# EAGLE design alarm (EAGLE 7.5.0)
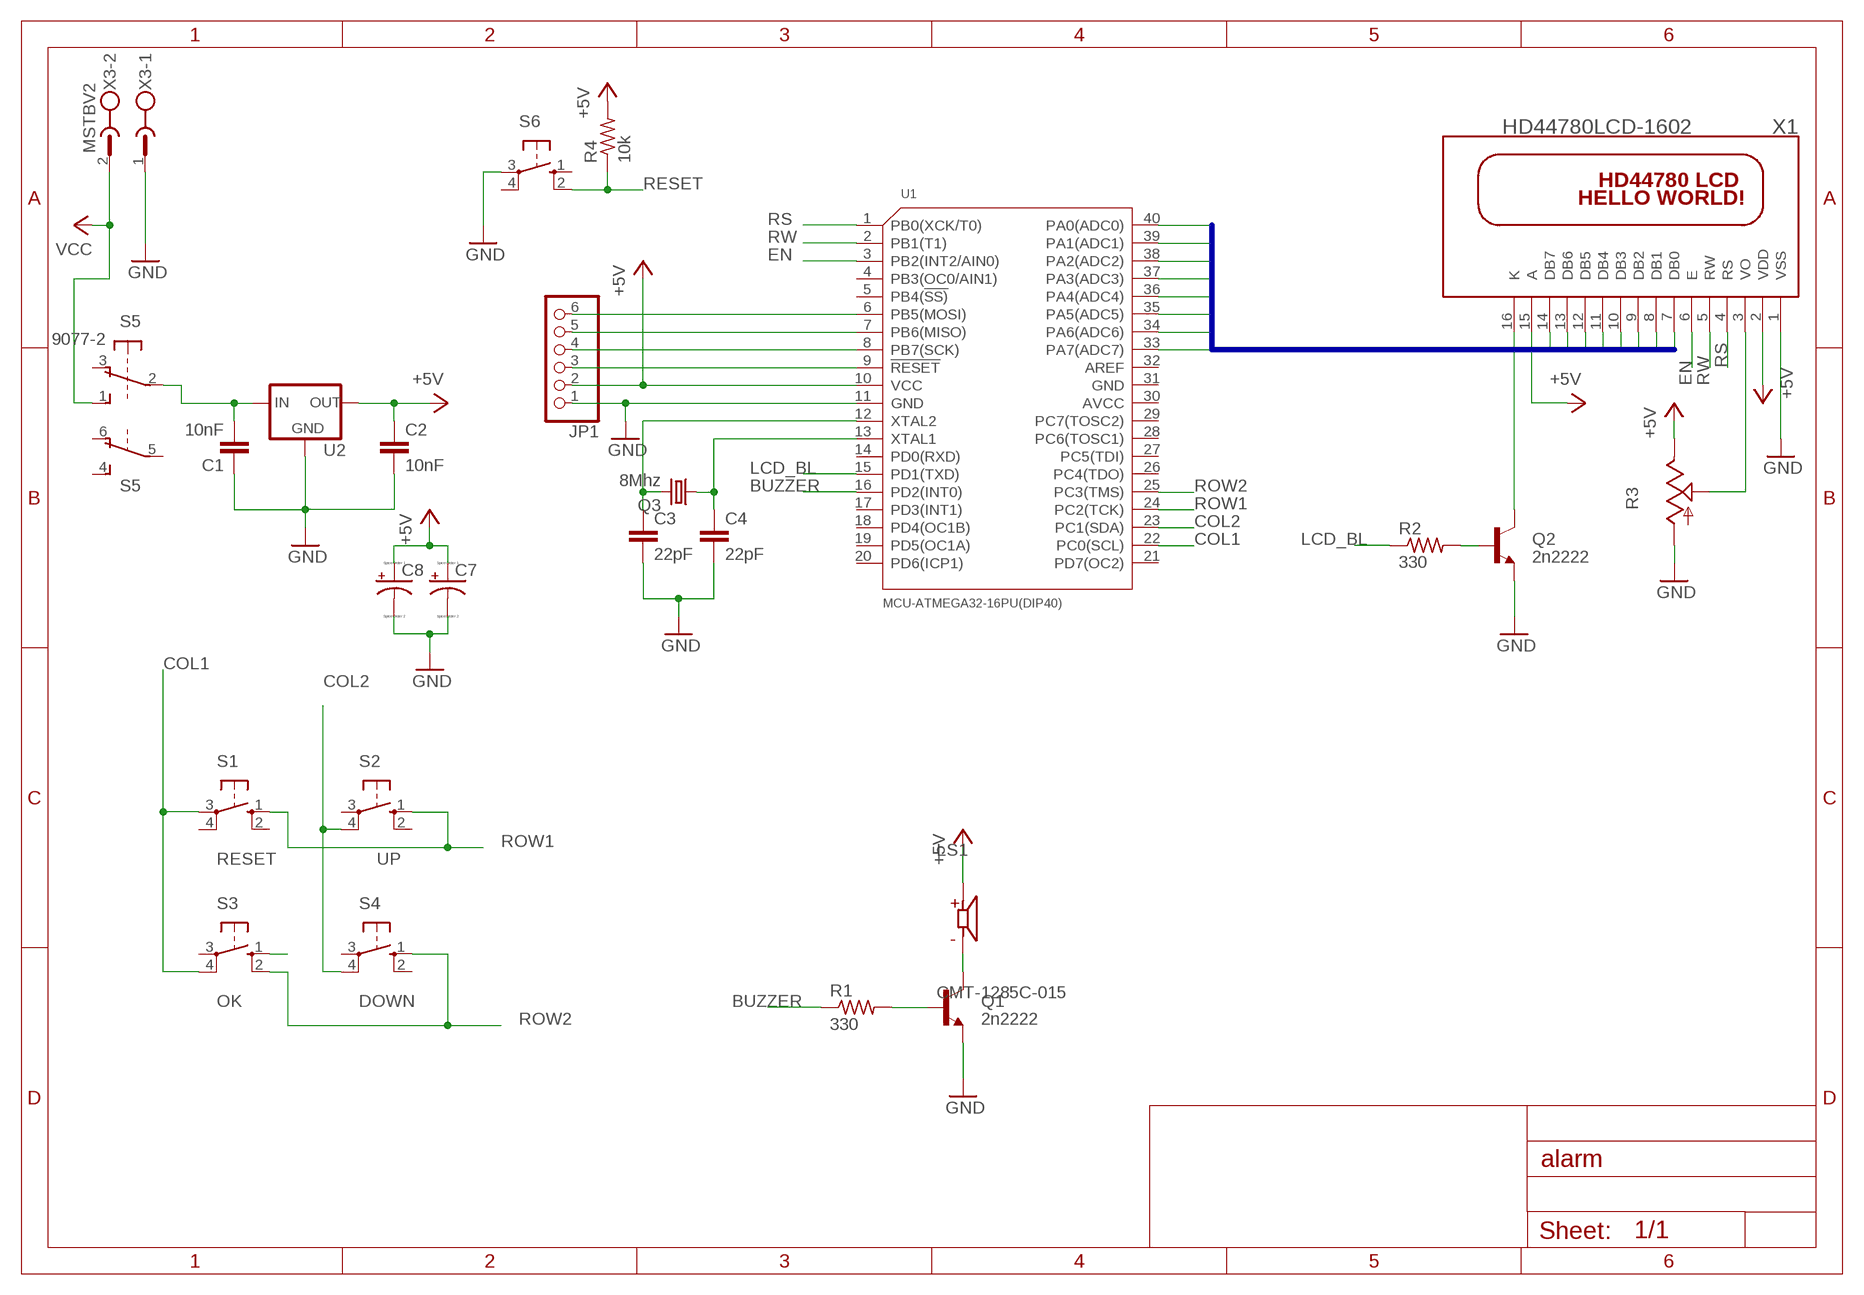
[diagram p0: schematic, sheet 1]

## Parts
C1  10nF  C-EU025-025X050  [C025-025X050]
C2  10nF  C-EU025-025X050  [C025-025X050]
C3  22pF  C-EU025-025X050  [C025-025X050]
C4  22pF  C-EU025-025X050  [C025-025X050]
C7  CPOL-USE2.5-6  [E2,5-6]
C8  CPOL-USE2.5-6  [E2,5-6]
JP1  PINHD-1X6  [1X06]
LS1  CMT-1285C-015  [CUI_CMT-1285C-015]
Q1  2n2222  TRANSISTOR_NPNP2N2222A  [TO-92]
Q2  2n2222  TRANSISTOR_NPNP2N2222A  [TO-92]
Q3  8Mhz  CRYSTALHC49S  [HC49/S]
R1  330  R-US_0207/10  [0207/10]
R2  330  R-US_0207/10  [0207/10]
R3  TRIM_US-RS3  [RS3]
R4  10k  R-US_0207/10  [0207/10]
S1  10-XX  [B3F-10XX]
S2  10-XX  [B3F-10XX]
S3  10-XX  [B3F-10XX]
S4  10-XX  [B3F-10XX]
S5  9077-2  [9077-2]
S6  10-XX  [B3F-10XX]
U1  MCU-ATMEGA32-16PU(DIP40)  [DIP40-2.54-52.3X15.24MM]
U2  78XXL  [78XXL]
X1  HD44780LCD-1602  [LCD1602]
X3  MSTBV2  [MSTBV2]

## Nets
+5V: C2.1 C7.+ C8.+ JP1.2 LS1.P R3.E R4.2 U1.10(VCC) U2.OUT X1.2(VDD) X1.15(A)
BUZZER: R1.1 U1.16(PD2(INT0))
COL1: S1.3(P) S3.4(P1) U1.22(PC0(SCL))
COL2: S2.4(P1) S4.4(P1) U1.23(PC1(SDA))
EN: U1.3(PB2(INT2/AIN0)) X1.6(E)
GND: C1.1 C2.2 C3.2 C4.2 C7.- C8.- JP1.1 Q1.3(E) Q2.3(E) R3.A S6.3(P) U1.11(GND) U2.GND X1.1(VSS) X3.1
LCD_BL: R2.1 U1.15(PD1(TXD))
N$1: C1.2 S5.2(1:P) U2.IN
N$2: Q1.2(B) R1.2
N$3: LS1.N Q1.1(C)
N$4: C3.1 Q3.2 U1.12(XTAL2)
N$5: C4.1 Q3.1 U1.13(XTAL1)
N$6: S3.1(S)
N$9: JP1.4 U1.8(PB7(SCK))
N$10: JP1.5 U1.7(PB6(MISO))
N$11: JP1.6 U1.6(PB5(MOSI))
N$12: Q2.1(C) X1.16(K)
N$13: Q2.2(B) R2.2
N$14: R3.S X1.3(VO)
PA0: U1.40(PA0(ADC0)) X1.7(DB0)
PA1: U1.39(PA1(ADC1)) X1.8(DB1)
PA2: U1.38(PA2(ADC2)) X1.9(DB2)
PA3: U1.37(PA3(ADC3)) X1.10(DB3)
PA4: U1.36(PA4(ADC4)) X1.11(DB4)
PA5: U1.35(PA5(ADC5)) X1.12(DB5)
PA6: U1.34(PA6(ADC6)) X1.13(DB6)
PA7: U1.33(PA7(ADC7)) X1.14(DB7)
RESET: JP1.3 R4.1 S6.2(S1) U1.9(!RESET)
ROW1: S1.1(S) S2.1(S) U1.24(PC2(TCK))
ROW2: S3.2(S1) S4.1(S) U1.25(PC3(TMS))
RS: U1.1(PB0(XCK/T0)) X1.4(RS)
RW: U1.2(PB1(T1)) X1.5(RW)
VCC: S5.1(1:S) X3.2
Unconnected: S1.2(S1) S1.4(P1) S2.2(S1) S2.3(P) S3.3(P) S4.2(S1) S4.3(P) S5.3(1:O) S5.4(2:S) S5.5(2:P) S5.6(2:O) S6.1(S) S6.4(P1) U1.4(PB3(OC0/AIN1)) U1.5(PB4(!SS)) U1.14(PD0(RXD)) U1.17(PD3(INT1)) U1.18(PD4(OC1B)) U1.19(PD5(OC1A)) U1.20(PD6(ICP1)) U1.21(PD7(OC2)) U1.26(PC4(TDO)) U1.27(PC5(TDI)) U1.28(PC6(TOSC1)) U1.29(PC7(TOSC2)) U1.30(AVCC) U1.31(GND) U1.32(AREF)

## Buses
PA[0..7]

## Notes on the sheet
- RESET | UP
- OK | DOWN

## Library data of the parts
C1-C4 = resistor:C-EU: CAPACITOR, European symbol
C7 C8 = resistor:CPOL-US: POLARIZED CAPACITOR, American symbol
JP1 = pinhead:PINHD-1X6: PIN HEADER
LS1 = CMT-1285C-015:CMT-1285C-015: 12 mm, 1.5 Vo-p, 91 dB, Through Hole, Magnetic Audio Transducer Buzzer Check prices <https://pricing.snapeda.com/parts/CMT-1285C-015/CUI%20Devices/view-part?ref=eda>; AVAILABILITY: Warning; CUI_PURCHASE_URL: https://www.cuidevices.com/product/audio/buzzers/audio-transducers/cmt-1285c-015?utm_source=snapeda.com&utm_medium=referral&utm_campaign=snapedaBOM; DESCRIPTION: 12 mm, 1.5 Vo-p, 91 dB, Through Hole, Magnetic Audio Transducer Buzzer; MF: CUI Devices; MP: CMT-1285C-015; PACKAGE: TO-220 CUI Inc.; PRICE: None; PURCHASE-URL: https://pricing.snapeda.com/search/part/CMT-1285C-015/?ref=eda
Q1 Q2 = SparkFun-DiscreteSemi:TRANSISTOR_NPN: Generic NPN BJT MMBT2222A - TRANS-08049 (SOT-23, 1A 40V) MPSA42 - TRANS-09116 (SOT-23, 500mA 300V) MMBT5088LT1G - TRANS-11160 (SOT-23, 50 mA 30V) BC547 - COM-08928 <http://www.sparkfun.com/products/8928> (TO-92 45V 100mA) (1.Collector 2.Base 3.Emitter) 2N3904 - COM-00521 <http://www.sparkfun.com/products/521> (TO-92 40V 200mA) (1.Emitter 2.Base 3.Collector) P2N2222A - COM-12852 <http://www.sparkfun.com/products/12852> (TO-92 40V 600mA) (1.Collector 2.Base 3.Emitter); PROD_ID: TRANS-09536
Q3 = crystal:CRYSTAL: CRYSTAL; OC_FARNELL: 1667008; OC_NEWARK: unknown
R1 R2 R4 = resistor:R-US_: RESISTOR, American symbol
R3 = pot:TRIM_US-: POTENTIOMETER
S1-S4 S6 = switch-omron:10-XX: OMRON SWITCH; MPN: B3F-1000; OC_FARNELL: 176432; OC_NEWARK: 36M3542
S5 = switch-misc:9077-2: MARQUARDT SWITCH 9077.0200 Distributor: Buerklin <https://www.buerklin.com/default.asp?event=ShowArtikel%2812G2822%29&l=d&jump=ArtNr_12G2822>
U1 = MCU-ATMEGA32-16PU_DIP40_:MCU-ATMEGA32-16PU(DIP40): 310010127 Check prices <https://pricing.snapeda.com/parts/ATMEGA32-16PU/Microchip/view-part?ref=eda>; AVAILABILITY: Good; DESCRIPTION: AVR AVR® ATmega Microcontroller IC 8-Bit 16MHz 32KB (16K x 16) FLASH 40-PDIP; MF: Microchip; MP: ATMEGA32-16PU; PACKAGE: DIP-40 Microchip; PRICE: None; PURCHASE-URL: https://pricing.snapeda.com/search/part/ATMEGA32-16PU/?ref=eda
U2 = v-reg:78XXL: VOLTAGE REGULATOR
X1 = adafruit:HD44780LCD: HD44780 LCD Standard character type LCDs, available in sizes from 8x1 to 40x4!
X3 = con-phoenix-508:MSTBV2: PHOENIX; MPN: MSTBV 2,5/2-GF-5.08; OC_FARNELL: 1792792; OC_NEWARK: 69R9845

## Board
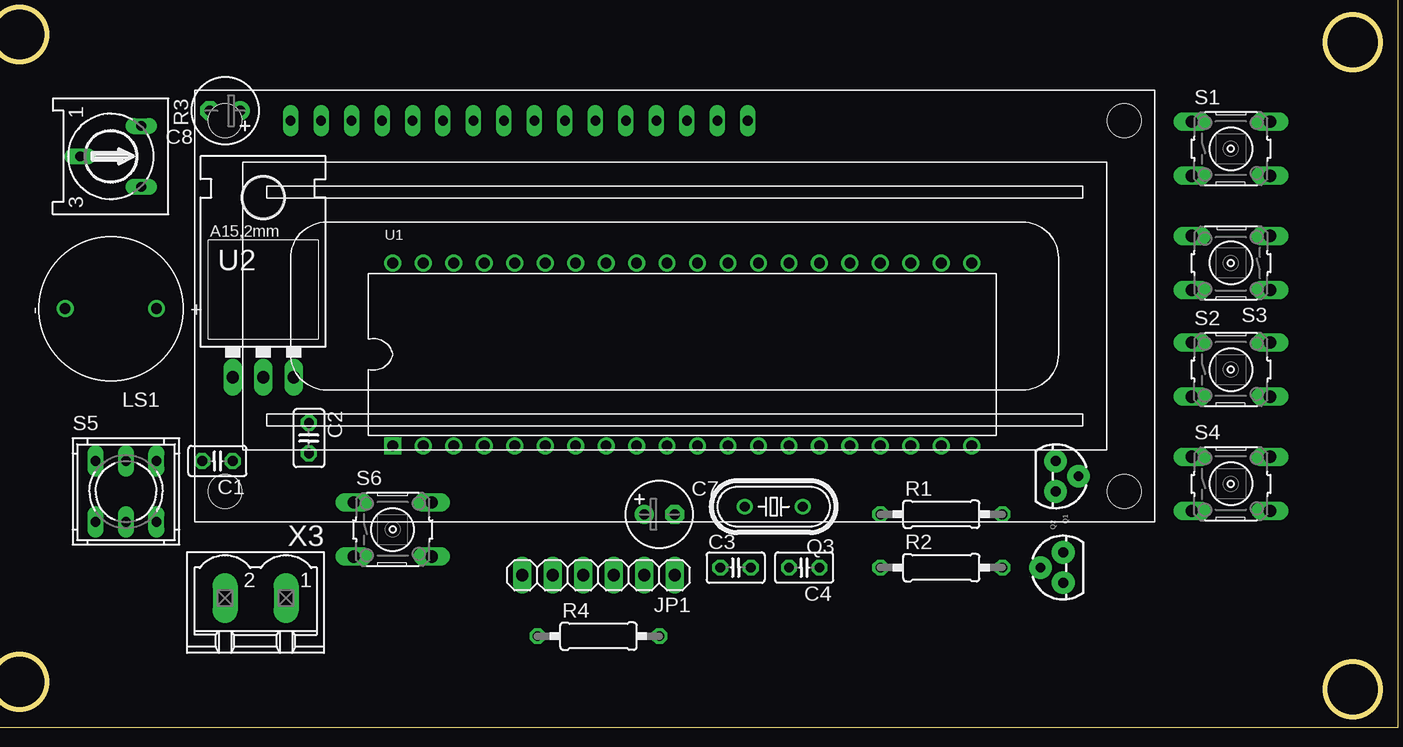
[diagram p1: board, top side]
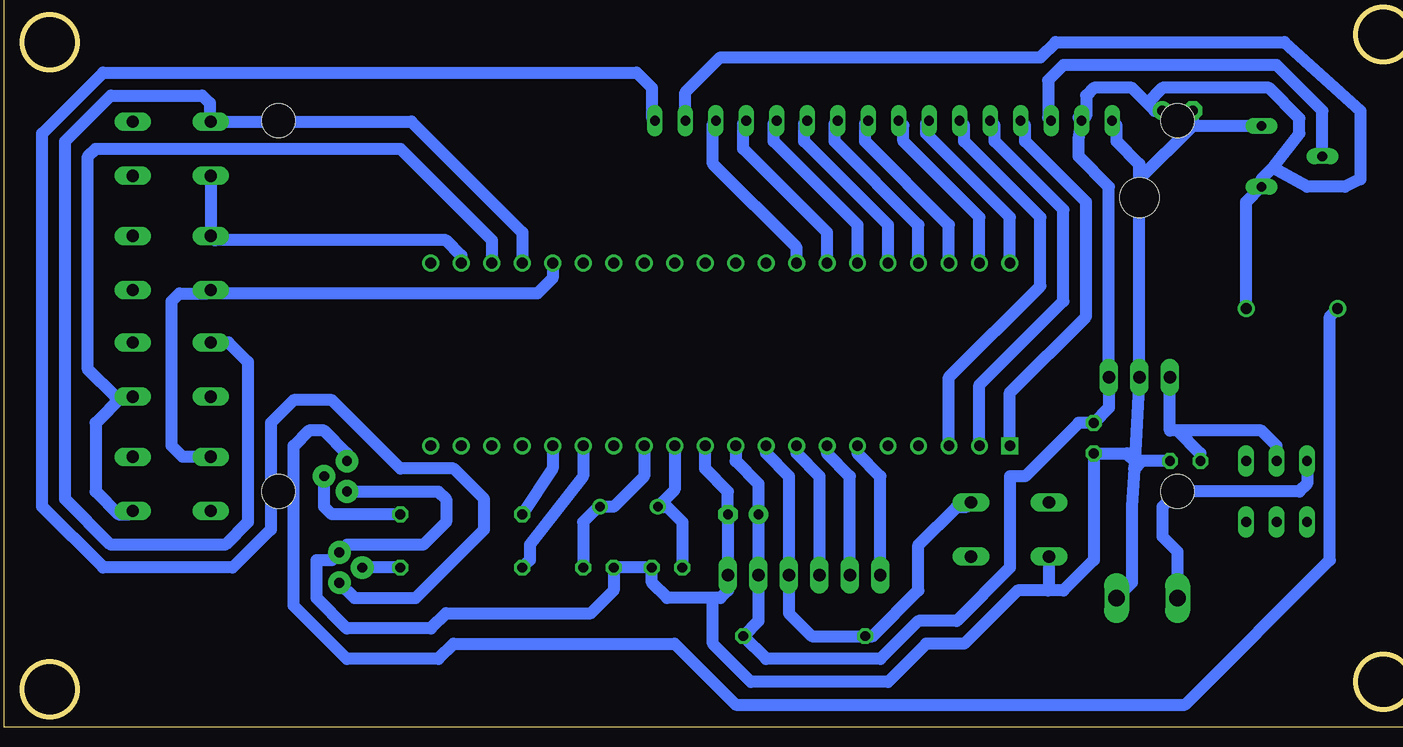
[diagram p2: board, bottom side, seen from below]

No outline drawn. Coordinates in mm, seen from the top.
Copper layers (1*16): Top 0.035mm / dielectric 1.5mm / Bottom 0.035mm
Design rules "default *": minimum track width 10mil, minimum drill 1mm, track to track 8mil, track to pad 8mil, pad to pad 8mil, via to via 8mil, smd to smd 8mil, copper to edge 40mil, drill to drill 8mil, minimum pad ring 10mil, minimum via ring 8mil, stop-mask expansion 4mil, vias tented up to drill 0mil, thermal gap 10mil
Milling: area 19.9,58.7 to 24.5,63.2; area 19.9,4.7 to 24.5,9.3; area 131.1,58 to 135.6,62.6; area 131.1,4.1 to 135.6,8.6; 4 lines

### Footprints (pad centres in the part's own frame; a part is rotated, then mirrored left to right if it is on the bottom)
C025-025X050 = drill 0.813 octagon: 1 -1.27,0; 2 1.27,0
E2,5-6 = drill 0.813 pad 1.6: + -1.27,0 | drill 0.813 pad 1.6 octagon: - 1.27,0
1X06 = drill 1.016 long: 1 -6.35,0; 2 -3.81,0; 3 -1.27,0; 4 1.27,0; 5 3.81,0; 6 6.35,0
CUI_CMT-1285C-015 = drill 0.9: N 3.81,0; P -3.81,0
TO-92 = drill 0.813 pad 1.88: 1 -1.27,0; 2 0,1.905; 3 1.27,0
HC49/S = drill 0.813: 1 -2.413,0; 2 2.413,0
0207/10 = drill 0.813 octagon: 1 -5.08,0; 2 5.08,0
RS3 = drill 0.813 long: A -2.54,2.54; E 2.54,2.54; S 0,-2.54
B3F-10XX = drill 1.016 long: 1 -3.251,2.261; 2 3.251,2.261; 3 -3.251,-2.261; 4 3.251,-2.261
9077-2 = drill 0.813 long: 1 -2.54,2.54; 2 0,2.54; 3 2.54,2.54; 4 -2.54,-2.54; 5 0,-2.54; 6 2.54,-2.54
DIP40-2.54-52.3X15.24MM = drill 0.9 pad 1.4 square: 1 -24.13,-7.62 | drill 0.9 pad 1.4: 2 -21.59,-7.62; 3 -19.05,-7.62; 4 -16.51,-7.62; 5 -13.97,-7.62; 6 -11.43,-7.62; 7 -8.89,-7.62; 8 -6.35,-7.62; 9 -3.81,-7.62; 10 -1.27,-7.62; 11 1.27,-7.62; 12 3.81,-7.62; 13 6.35,-7.62; 14 8.89,-7.62; 15 11.43,-7.62; 16 13.97,-7.62; 17 16.51,-7.62; 18 19.05,-7.62; 19 21.59,-7.62; 20 24.13,-7.62; 21 24.13,7.62; 22 21.59,7.62; 23 19.05,7.62; 24 16.51,7.62; 25 13.97,7.62; 26 11.43,7.62; 27 8.89,7.62; 28 6.35,7.62; 29 3.81,7.62; 30 1.27,7.62; 31 -1.27,7.62; 32 -3.81,7.62; 33 -6.35,7.62; 34 -8.89,7.62; 35 -11.43,7.62; 36 -13.97,7.62; 37 -16.51,7.62; 38 -19.05,7.62; 39 -21.59,7.62; 40 -24.13,7.62
78XXL = drill 1.016 long: GND 0,-3.81; IN -2.54,-3.81; OUT 2.54,-3.81 | hole 3.302: 0,11.176
LCD1602 = drill 0.8 long: 1 8,33.46; 2 10.54,33.46; 3 13.08,33.46; 4 15.62,33.46; 5 18.16,33.46; 6 20.7,33.46; 7 23.24,33.46; 8 25.78,33.46; 9 28.32,33.46; 10 30.86,33.46; 11 33.4,33.46; 12 35.94,33.46; 13 38.48,33.46; 14 41.02,33.46; 15 43.56,33.46; 16 46.1,33.46 | hole 2.8: 2.54,2.54; 2.54,33.46; 77.46,33.46; 77.46,2.54
MSTBV2 = drill 1.397 long: 1 -2.54,0; 2 2.54,0

### Placement (x,y rotation side)
C1  38.73,25.4 180 top
C2  46.35,27.3 270 top
C3  81.92,16.51 0 top
C4  87.63,16.51 180 top
C7  75.56,20.95 0 top
C8  39.37,54.61 180 top
JP1  70.48,15.88 180 top
LS1  29.84,38.1 180 top
Q1  108.58,24.13 270 top
Q2  109.22,16.51 90 top
Q3  85.09,21.59 180 top
R1  99.06,20.95 0 top
R2  99.06,16.51 0 top
R3  29.84,50.8 270 top
R4  70.48,10.79 0 top
S1  123.19,51.44 0 top
S2  123.19,33.02 0 top
S3  123.19,41.91 180 top
S4  123.19,23.5 0 top
S5  31.11,22.86 0 top
S6  53.34,19.68 0 top
U1  77.47,34.29 0 top
U2  42.55,36.2 0 top
X1  36.83,20.32 0 top
X3  41.91,13.97 180 top

### Tracks (layer width: path | path; a pad name or v marks a point on that pad's centre or on a via)
+5V
  Bottom 1.016: U1.10 76.2,25.4 74.3,23.5 C7.+ JP1.2 74.3,12.06 R4.2 73.66,8.89 64.14,8.89 60.96,12.06 57.78,12.06 53.34,16.51 53.34,24.13 52.07,24.13 47.62,28.57 C2.1 45.09,29.84 U2.OUT 45.09,48.26 47.62,50.8 47.62,52.26 X1.2 | 47.62,54.03 X1.2 | LS1.P 33.66,46.99 R3.E 32.38,48.9 31.43,49.85 | C8.+ 41.27,54.61 41.91,55.24 | 41.91,55.24 43.18,56.52 46.35,56.52 46.99,55.88 46.99,54.16 X1.2 | 31.43,49.85 29.21,52.7 29.21,53.98 31.75,56.52 40.64,56.52 41.91,55.24 | X1.15 80.39,56.13 77.47,59.05 50.8,59.05 49.53,60.33 30.48,60.33 24.13,54.61 24.13,48.9 25.4,48.26 28.57,48.26 31.43,49.85
BUZZER
  Bottom 1.016: U1.16 91.44,24.77 R1.1
COL1
  Bottom 1.016: S1.3 S3.4 119.58,43.81 100.33,43.81 99.06,42.55 U1.22
COL2
  Bottom 1.016: U1.23 96.52,43.81 104.14,51.44 129.54,51.44 130.18,50.8 130.18,33.02 127.91,30.76 S2.4 127.36,30.76 129.54,28.57 129.54,22.86 127.64,20.95 126.72,20.95 S4.4
EN
  Bottom 1.016: U1.3 58.42,32.38 50.8,40.01 50.8,45.72 57.15,52.07 57.15,53.4 X1.6
GND
  Bottom 1.016: 42.96,25.39 U2.GND 42.55,48.9 | 42.96,25.39 42.99,24.75 | 42.99,24.75 43.18,21.59 43.18,15.24 X3.1 | U1.11 78.74,24.77 76.83,22.86 C7.- JP1.1 76.83,14.61 77.47,13.97 78.11,13.97 | 78.11,13.97 81.92,13.97 83.19,15.24 C3.2 C4.2 86.36,14.61 88.27,12.7 100.33,12.7 101.6,11.43 108.58,11.43 111.12,13.97 111.12,17.14 109.86,17.14 Q2.3 108.58,18.41 102.23,18.41 100.33,20.32 100.33,22.23 100.97,22.86 Q1.3 | 78.11,13.97 78.11,10.16 74.93,6.99 63.5,6.99 60.33,10.16 57.15,10.16 52.7,14.61 50.16,14.61 | C1.1 42.35,25.4 42.99,24.75 | 42.96,25.39 43.6,26.04 C2.2 46.35,17.14 48.9,14.61 50.16,14.61 | 42.55,48.9 42.55,50.16 44.45,52.07 44.45,53.34 | 44.45,53.34 44.45,53.4 X1.1 44.83,53.72 44.45,53.34 | C8.- 38.1,53.34 | 38.1,53.34 42.55,48.9 | R3.A 38.1,53.34 | S6.3 50.09,14.68 50.16,14.61
LCD_BL
  Bottom 1.016: U1.15 88.9,24.13 93.34,18.41 93.34,17.14 R2.1
N$1
  Bottom 1.016: S5.2 31.11,26.67 32.38,27.94 39.37,27.94 | 39.37,27.94 40.01,27.94 U2.IN | C1.2 37.47,26.04 39.37,27.94
N$2
  Bottom 1.016: R1.2 109.86,20.95 110.49,21.59 Q1.2
N$3
  Bottom 1.016: Q1.1 108.58,26.04 110.49,27.94 111.76,27.94 113.03,26.67 113.03,13.34 108.58,8.89 100.97,8.89 99.69,10.16 81.28,10.16 76.2,5.08 38.73,5.08 26.67,17.14 26.67,37.47 LS1.N
N$4
  Bottom 1.016: U1.12 81.28,22.99 Q3.2 81.92,21.59 80.64,20.32 C3.1
N$5
  Bottom 1.016: U1.13 83.82,24.13 86.36,21.59 Q3.1 87.63,21.59 88.9,20.32 C4.1
N$9
  Bottom 1.016: U1.8 71.12,26.04 69.22,24.13 JP1.4
N$10
  Bottom 1.016: JP1.5 66.67,24.13 68.58,26.04 U1.7
N$11
  Bottom 1.016: JP1.6 64.14,24.13 66.04,26.04 U1.6
N$12
  Bottom 1.016: Q2.1 107.95,13.97 102.87,13.97 97.16,19.68 97.16,22.23 99.69,24.77 104.14,24.77 109.86,30.48 113.03,30.48 114.94,28.57 114.94,19.68 118.11,16.51 128.91,16.51 133.99,21.59 133.99,52.7 128.91,57.78 84.45,57.78 83.19,56.52 83.19,54.03 X1.16
N$13
  Bottom 1.016: R2.2 Q2.2
N$14
  Bottom 1.016: R3.S 27.3,54.61 31.11,58.42 48.9,58.42 50.16,57.15 50.16,54.03 X1.3
PA0
  Bottom 1.016: U1.40 53.34,45.72 60.33,52.7 60.33,53.52 X1.7
PA1
  Bottom 1.016: U1.39 55.88,45.72 62.23,52.07 62.23,53.4 X1.8
PA2
  Bottom 1.016: U1.38 58.42,45.09 65.41,52.07 65.41,53.52 X1.9
PA3
  Bottom 1.016: U1.37 60.96,45.09 67.94,52.07 67.94,53.52 X1.10
PA4
  Bottom 1.016: U1.36 63.5,45.09 70.48,52.07 70.48,53.52 X1.11
PA5
  Bottom 1.016: U1.35 66.04,45.09 73.03,52.07 73.03,53.52 X1.12
PA6
  Bottom 1.016: U1.34 68.58,44.45 75.56,51.44 75.56,53.52 X1.13
PA7
  Bottom 1.016: U1.33 71.12,43.18 78.11,50.16 78.11,53.52 X1.14
RESET
  Bottom 1.016: U1.9 73.66,26.04 71.75,24.13 JP1.3 71.75,12.7 69.85,10.79 R4.1 64.77,10.79 60.96,14.61 60.96,18.41 57.78,21.59 56.95,21.59 S6.2
ROW1
  Bottom 1.016: U1.24 93.98,44.45 103.23,53.7 S1.1 120.02,53.77 120.02,55.24 120.65,55.88 128.27,55.88 132.08,52.07 132.08,22.23 128.27,18.41 118.75,18.41 116.84,20.32 116.84,33.66 118.47,35.28 S2.1
ROW2
  Bottom 1.016: U1.25 91.44,40.64 92.71,39.37 119.66,39.37 S3.2 120.22,39.37 122.56,39.37 123.19,38.73 123.19,26.67 122.28,25.76 S4.1
RS
  Bottom 1.016: U1.1 53.34,31.11 46.99,37.47 46.99,46.99 52.07,52.07 52.07,53.4 X1.4
RW
  Bottom 1.016: U1.2 55.88,31.75 48.9,38.73 48.9,46.35 54.61,52.07 54.61,53.4 X1.5
VCC
  Bottom 1.016: S5.1 28.57,23.5 29.21,22.86 39.37,22.86 40.64,21.59 40.64,19.1 39.37,17.83 X3.2

### Text on the board
Document: RESET | OK | UP | DOWN | VCC | GND